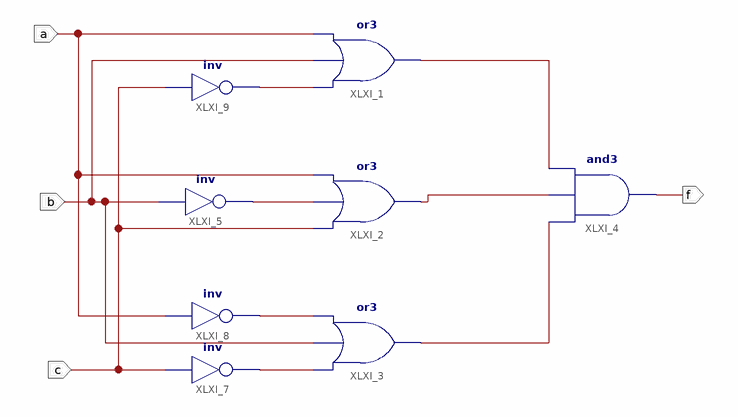
[diagram p0: schematic sheet 1]
// Xilinx ISE schematic zrodlo.sch (spartan3e) as structural Verilog: 8 symbols, 4 ports
module zrodlo (
  input  c,
  input  b,
  input  a,
  output f
);

  wire XLXN_3, XLXN_5, XLXN_7, XLXN_11, XLXN_14, XLXN_15, XLXN_23;

  or XLXI_1 (XLXN_23, XLXN_7, b, a);
  or XLXI_2 (XLXN_14, c, XLXN_3, a);
  or XLXI_3 (XLXN_15, XLXN_5, b, XLXN_11);
  and XLXI_4 (f, XLXN_15, XLXN_14, XLXN_23);
  not XLXI_5 (XLXN_3, b);
  not XLXI_7 (XLXN_5, c);
  not XLXI_8 (XLXN_11, a);
  not XLXI_9 (XLXN_7, c);
endmodule
